# EAGLE schematic Valve_Controller1 (EAGLE 6.4)
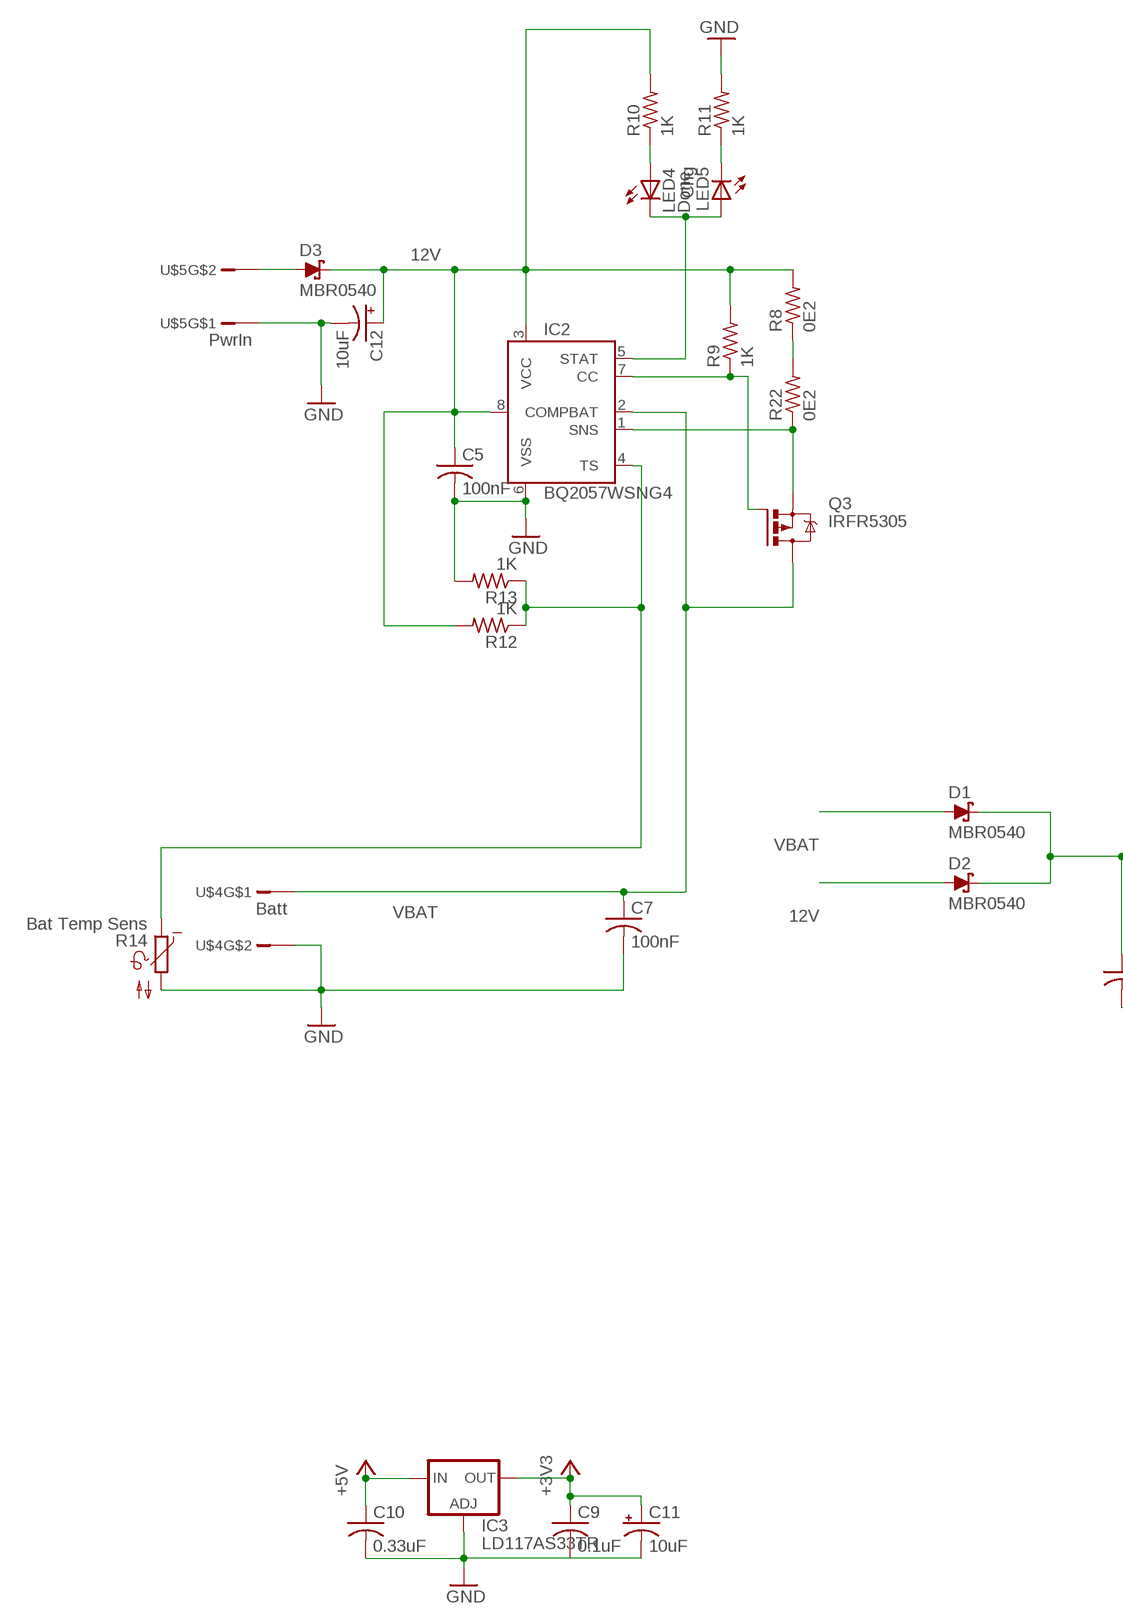
[diagram p0: schematic, sheet 1, part 1 of 2]
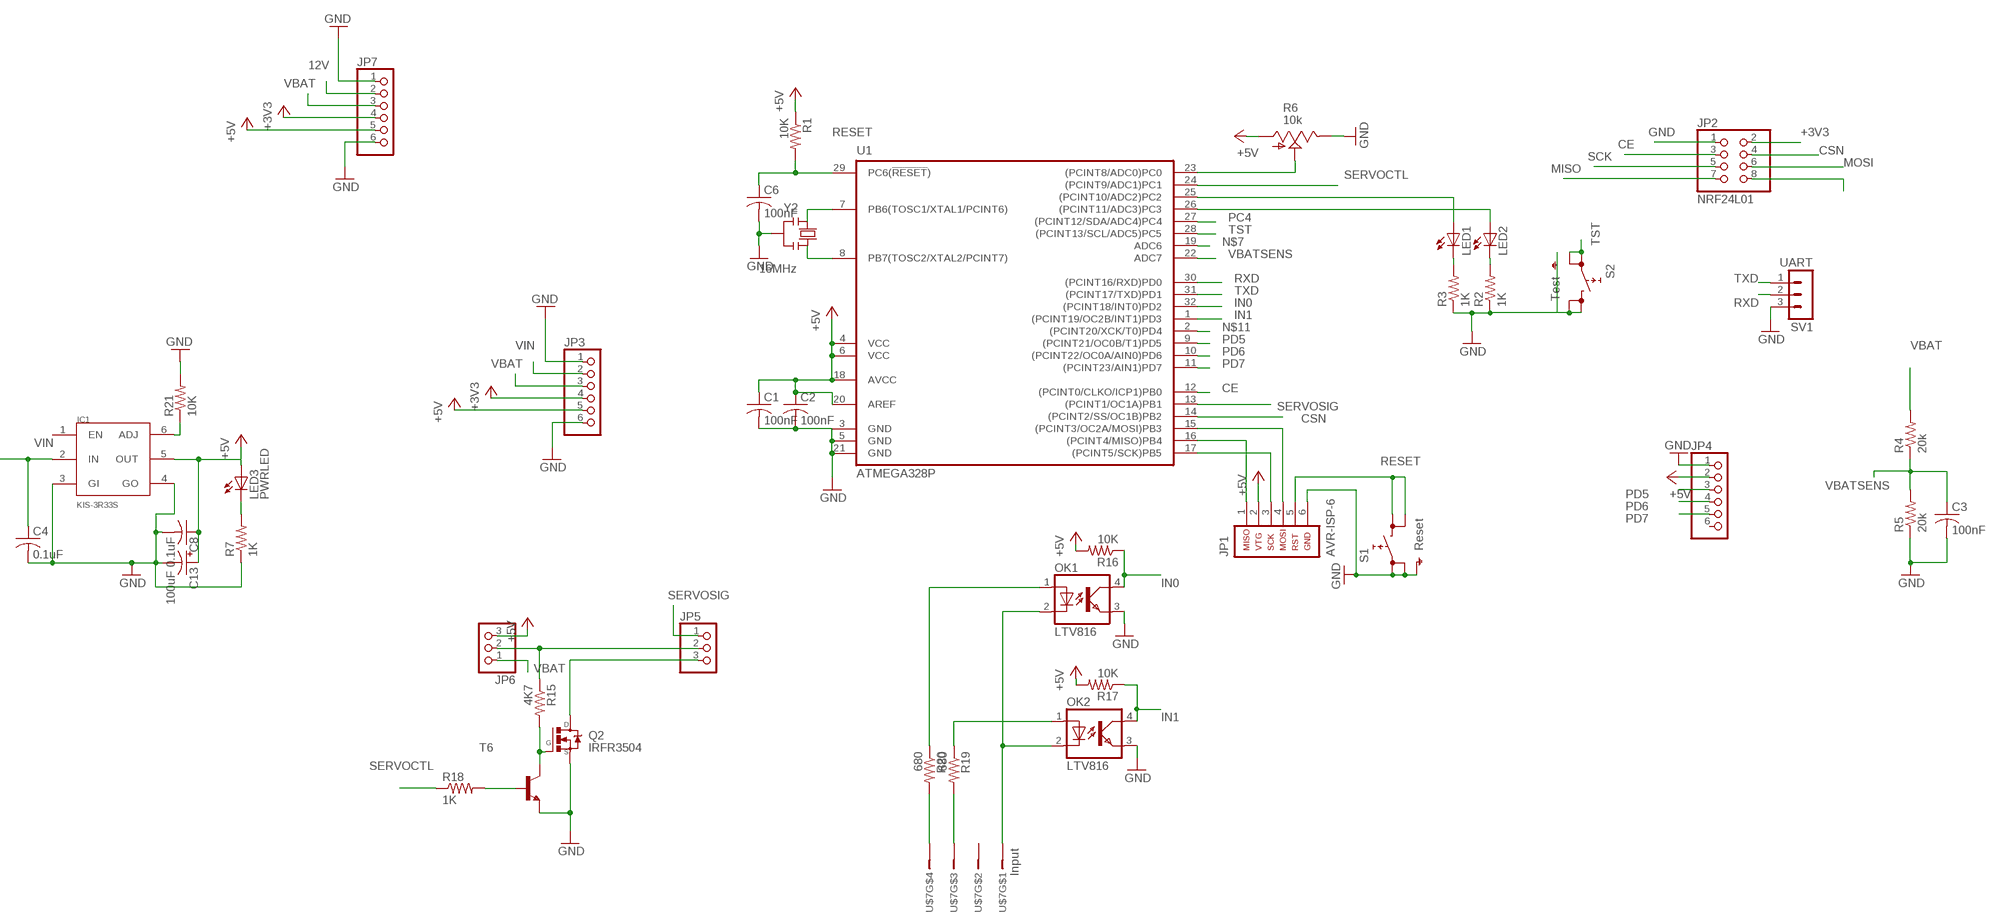
[diagram p1: schematic, sheet 1, part 2 of 2]

## Parts
C1  100nF  C-USC0805K  [C0805K]
C2  100nF  C-USC0805K  [C0805K]
C3  100nF  C-USC0805K  [C0805K]
C4  0.1uF  C-USC0805K  [C0805K]
C5  100nF  C-USC0805K  [C0805K]
C6  100nF  C-USC0805K  [C0805K]
C7  100nF  C-USC0805K  [C0805K]
C8  0.1uF  C-USC0805K  [C0805K]
C9  0.1uF  C-USC0805K  [C0805K]
C10  0.33uF  C-USC0805K  [C0805K]
C11  10uF  CPOL-US153CLV-0405  [153CLV-0405]
C12  10uF  CPOL-US153CLV-0405  [153CLV-0405]
C13  100uF  CPOL-USD  [PANASONIC_D]
D1  MBR0540  [SOD123]
D2  MBR0540  [SOD123]
D3  MBR0540  [SOD123]
IC1  KIS-3R33S  [KIS-3R33S]
IC2  BQ2057WSNG4  [D_R-PDSO-G8]
IC3  LD117AS33TR  [SOT223]
JP1  AVR-ISP-6  [AVR-ISP-6]
JP2  NRF24L01  PINHD-2X4  [2X04]
JP3  PINHD-1X6  [1X06]
JP4  PINHD-1X6  [1X06]
JP5  PINHD-1X3  [1X03]
JP6  PINHD-1X3  [1X03]
JP7  PINHD-1X6  [1X06]
LED1  LEDCHIPLED_0805  [CHIPLED_0805]
LED2  LEDCHIPLED_0805  [CHIPLED_0805]
LED3  PWRLED  LEDCHIPLED_0805  [CHIPLED_0805]
LED4  Done  LEDCHIPLED_0805  [CHIPLED_0805]
LED5  Chg  LEDCHIPLED_0805  [CHIPLED_0805]
OK1  LTV816  [DIL04]
OK2  LTV816  [DIL04]
Q2  IRFR3504  [DPAK]
Q3  IRFR5305  [D-PAK_TO252AA]
R1  10K  R-US_R0805  [R0805]
R2  1K  R-US_R0805  [R0805]
R3  1K  R-US_R0805  [R0805]
R4  20k  R-US_R0805  [R0805]
R5  20k  R-US_R0805  [R0805]
R6  10k  TRIM_US-CT6  [CT6]
R7  1K  R-US_R0805  [R0805]
R8  0E2  R-US_M1206  [M1206]
R9  1K  R-US_R0805  [R0805]
R10  1K  R-US_R0805  [R0805]
R11  1K  R-US_R0805  [R0805]
R12  1K  R-US_R0805  [R0805]
R13  1K  R-US_R0805  [R0805]
R14  Bat Temp Sens  NTC640  [P640]
R15  4K7  R-US_R0805  [R0805]
R16  10K  R-US_R0805  [R0805]
R17  10K  R-US_R0805  [R0805]
R18  1K  R-US_R0805  [R0805]
R19  680  R-US_R0805  [R0805]
R20  680  R-US_R0805  [R0805]
R21  10K  R-US_R0805  [R0805]
R22  0E2  R-US_M1206  [M1206]
S1  Reset  SKHMPSE010  [SKHMPXE010]
S2  Test  SKHMPSE010  [SKHMPXE010]
SV1  UART  MA03-1  [MA03-1]
T6  MMBT2222ALT1-NPN-SOT23-BEC  [SOT23-BEC]
U1  ATMEGA328P  ATMEGA48P/88P/168P/328P-A  [TQFP32A]
U$4  Batt  JST_PHR-2  [PHR-2]
U$5  PwrIn  JST_PHR-2  [PHR-2]
U$7  Input  JST_PHR-4  [PHR-4]
Y2  16MHz  RESONATORMU  [RESONATOR]

## Nets
12V: C5.1 C12.+ D2.A D3.C IC2.3(VCC) IC2.8(COMP) JP7.2 R8.2 R9.2 R10.2 R12.2
+3V3: C9.1 C11.+ IC3.4(OUT) JP2.2 JP3.4 JP7.4
+5V: C1.1 C2.1 C8.1 C10.1 C13.+ IC1.5(OUT) IC3.3(IN) JP1.2 JP3.5 JP4.2 JP6.3 JP7.5 LED3.A R1.1 R6.A R16.2 R17.2 U1.4(VCC) U1.6(VCC) U1.18(AVCC) U1.20(AREF)
CE: JP2.3 U1.12((PCINT0/CLKO/ICP1)PB0)
CSN: JP2.4 U1.14((PCINT2/SS/OC1B)PB2)
GND: C1.2 C2.2 C3.2 C4.2 C5.2 C6.2 C7.2 C8.2 C9.2 C10.2 C11.- C12.- C13.- IC1.3(GI) IC1.4(GO) IC2.6(VSS) IC3.1(ADJ) JP1.6 JP2.1 JP3.1 JP3.6 JP4.1 JP7.1 JP7.6 OK1.3(EMIT) OK2.3(EMIT) Q2.3(S) R2.1 R3.1 R5.1 R6.E R7.1 R11.2 R13.2 R14.2 R21.2 S1.1(1.1) S1.2(1.2) S1.5(SH) S2.3(2.1) S2.4(2.2) S2.5(SH) SV1.3 T6.E U1.5(GND) U1.21(GND) U$4.P$2 U$5.P$1 Y2.2
IN0: OK1.4(COL) R16.1 U1.32((PCINT18/INT0)PD2)
IN1: OK2.4(COL) R17.1 U1.1((PCINT19/OC2B/INT1)PD3)
MISO: JP1.1 JP2.7 U1.16((PCINT4/MISO)PB4)
MOSI: JP1.4 JP2.6 U1.15((PCINT3/OC2A/MOSI)PB3)
N$1: Q2.1(G) R15.2 T6.C
N$2: R6.S U1.23((PCINT8/ADC0)PC0)
N$3: LED1.A U1.25((PCINT10/ADC2)PC2)
N$4: LED2.A U1.26((PCINT11/ADC3)PC3)
N$5: JP2.8
N$6: R18.2 T6.B
N$7: U1.19(ADC6)
N$8: IC2.5(STAT) LED4.C LED5.A
N$9: U1.8(PB7(TOSC2/XTAL2/PCINT7)) Y2.3
N$10: U1.7(PB6(TOSC1/XTAL1/PCINT6)) Y2.1
N$11: U1.2((PCINT20/XCK/T0)PD4)
N$12: LED2.C R2.2
N$13: LED1.C R3.2
N$14: LED3.C R7.2
N$15: LED4.A R10.1
N$16: IC1.6(ADJ) R21.1
N$17: D3.A U$5.P$2
N$18: JP5.2 JP6.2 R15.1
N$19: R8.1 R22.2
N$22: JP5.3 Q2.4(D)
N$24: OK1.2(C) OK2.2(C) U$7.P$1
N$27: IC2.1(SNS) Q3.3(S) R22.1
N$29: IC2.7(CC) Q3.1(G) R9.1
N$30: LED5.C R11.1
N$32: IC2.4(TS) R12.1 R13.1 R14.1
N$33: R20.2 U$7.P$4
N$37: R19.2 U$7.P$3
N$39: OK1.1(A) R20.1
N$40: OK2.1(A) R19.1
PC4: U1.27((PCINT12/SDA/ADC4)PC4)
PD5: JP4.3 U1.9((PCINT21/OC0B/T1)PD5)
PD6: JP4.4 U1.10((PCINT22/OC0A/AIN0)PD6)
PD7: JP4.5 U1.11((PCINT23/AIN1)PD7)
RESET: C6.1 JP1.5 R1.2 S1.3(2.1) S1.4(2.2) U1.29(PC6(!RESET!))
RXD: SV1.2 U1.30((PCINT16/RXD)PD0)
SCK: JP1.3 JP2.5 U1.17((PCINT5/SCK)PB5)
SERVOCTL: R18.1 U1.24((PCINT9/ADC1)PC1)
SERVOSIG: JP5.1 U1.13((PCINT1/OC1A)PB1)
TST: S2.1(1.1) S2.2(1.2) U1.28((PCINT13/SCL/ADC5)PC5)
TXD: SV1.1 U1.31((PCINT17/TXD)PD1)
VBAT: C7.1 D1.A IC2.2(BAT) JP3.3 JP6.1 JP7.3 Q3.4(D) R4.2 U$4.P$1
VBATSENS: C3.1 R4.1 R5.2 U1.22(ADC7)
VIN: C4.1 D1.C D2.C IC1.2(IN) JP3.2
Unconnected: IC1.1(EN) JP4.6 U$7.P$2

## Power pins joined to a net without a drawn wire
GND: U1.3(GND)

## Library data of the parts
C1-C10 = resistor:C-US: CAPACITOR, American symbol
C11-C13 = resistor:CPOL-US: POLARIZED CAPACITOR, American symbol
D1-D3 = diode:MBR0540: schottky diode, 0.5A, 40V ON Semiconductor
IC1 = KIS-3R33S:KIS-3R33S: DC-DC Converter
IC2 = RobThePyro:BQ2057WSNG4: TI BQ2057WSNG4 1-2Cell Li-ion / lipo charger IC http://www.ti.com/lit/ds/symlink/bq2057w.pdf
IC3 = v-reg:LD117A?*: Low drop fixed and adjustable positive voltage regulators 1 A Source: http://www.st.com/stonline/products/literature/ds/7194/ld1117axx.pdf
JP1 = atmel:AVR-ISP-6: AVR ISP-6 Serial Programming Header
JP2 = pinhead:PINHD-2X4: PIN HEADER
JP3 JP4 JP7 = pinhead:PINHD-1X6: PIN HEADER
JP5 JP6 = pinhead:PINHD-1X3: PIN HEADER
LED1-LED5 = led:LED: LED OSRAM: - CHIPLED LG R971, LG N971, LY N971, LG Q971, LY Q971, LO R971, LY R971 LH N974, LH R974 LS Q976, LO Q976, LY Q976 LO Q996 - Hyper CHIPLED LW Q18S LB Q993, LB Q99A, LB R99A - SideLED LS A670, LO A670, LY A670, LG A670, LP A670 LB A673, LV A673, LT A673, LW A673 LH A674 LY A675 LS A676, LA A676, LO A676, LY A676, LW A676 LS A679, LY A679, LG A679 - Hyper Micro SIDELED® LS Y876, LA Y876, LO Y876, LY Y876 LT Y87S - SmartLED LW L88C, LW L88S LB L89C, LB L89S, LG L890 LS L89K, LO L89K, LY L89K LS L896, LA L896, LO L896, LY L896 - TOPLED LS T670, LO T670, LY T670, LG T670, LP T670 LSG T670, LSP T670, LSY T670, LOP T670, LYG T670 LG T671, LOG T671, LSG T671 LB T673, LV T673, LT T673, LW T673 LH T674 LS T676, LA T676, LO T676, LY T676, LB T676, LH T676, LSB T676, LW T676 LB T67C, LV T67C, LT T67C, LS T67K, LO T67K, LY T67K, LW E67C LS E67B, LA E67B, LO E67B, LY E67B, LB E67C, LV E67C, LT E67C LW T67C LS T679, LY T679, LG T679 LS T770, LO T770, LY T770, LG T770, LP T770 LB T773, LV T773, LT T773, LW T773 LH T774 LS E675, LA E675, LY E675, LS T675 LS T776, LA T776, LO T776, LY T776, LB T776 LHGB T686 LT T68C, LB T68C - Hyper Mini TOPLED® LB M676 - Mini TOPLED Santana® LG M470 LS M47K, LO M47K, LY M47K Source: http://www.osram.convergy.de LUXEON: - LUMILED® LXK2-PW12-R00, LXK2-PW12-S00, LXK2-PW14-U00, LXK2-PW14-V00 LXK2-PM12-R00, LXK2-PM12-S00, LXK2-PM14-U00 LXK2-PE12-Q00, LXK2-PE12-R00, LXK2-PE12-S00, LXK2-PE14-T00, LXK2-PE14-U00 LXK2-PB12-K00, LXK2-PB12-L00, LXK2-PB12-M00, LXK2-PB14-N00, LXK2-PB14-P00, LXK2-PB14-Q00 LXK2-PR12-L00, LXK2-PR12-M00, LXK2-PR14-Q00, LXK2-PR14-R00 LXK2-PD12-Q00, LXK2-PD12-R00, LXK2-PD12-S00 LXK2-PH12-R00, LXK2-PH12-S00 LXK2-PL12-P00, LXK2-PL12-Q00, LXK2-PL12-R00 Source: www.luxeon.com KINGBRIGHT: KA-3528ASYC Source: www.kingbright.com
OK1 OK2 = optocoupler:LTV816: OPTO COUPLER Source: LITEON, LTV816.pdf; OC_FARNELL: unknown; OC_NEWARK: unknown
Q2 = transistor-fet:IRFR3504: N-Channel HEXFET
Q3 = transistor-power:IRF?5305: HEXFET Power MOSFET Source: http://www.irf.com/product-info/datasheets/data/irfr5305pbf.pdf
R1-R5 R7-R13 R15-R22 = resistor:R-US_: RESISTOR, American symbol
R6 = pot:TRIM_US-: POTENTIOMETER
R14 = ptc-ntc:NTC640: PHILIPS NTC; OC_FARNELL: unknown; OC_NEWARK: unknown
S1 S2 = switch:SKHMP*E010: 6.2 X 6.5mm TACT Switch (SMD) Source: http://www3.alps.co.jp/WebObjects/catalog.woa/PDF/E/Switch/Tact/SKHM/SKHM.PDF
SV1 = con-lstb:MA03-1: PIN HEADER; OC_FARNELL: unknown; OC_NEWARK: unknown
T6 = transistor:*-NPN-: NPN Transistror BF959 corrected 2008.03.06
U1 = atmel-avr:ATMEGA48P/88P/168P/328P: MICROCONTROLLER 4/8/16/32K Flash
U$4 U$5 = RobThePyro:JST_PHR-2
U$7 = RobThePyro:JST_PHR-4
Y2 = SmartPrj:RESONATOR

## Net classes
0 default: width 0.152 mm, drill 0.305 mm, clearance 0.152 mm